# EAGLE design ps2_cpld_kbd (EAGLE 9.3.1)
CNAME: PS/2 keyboard adapter; CREVISION: 1.2; DESIGNER: andykarpov
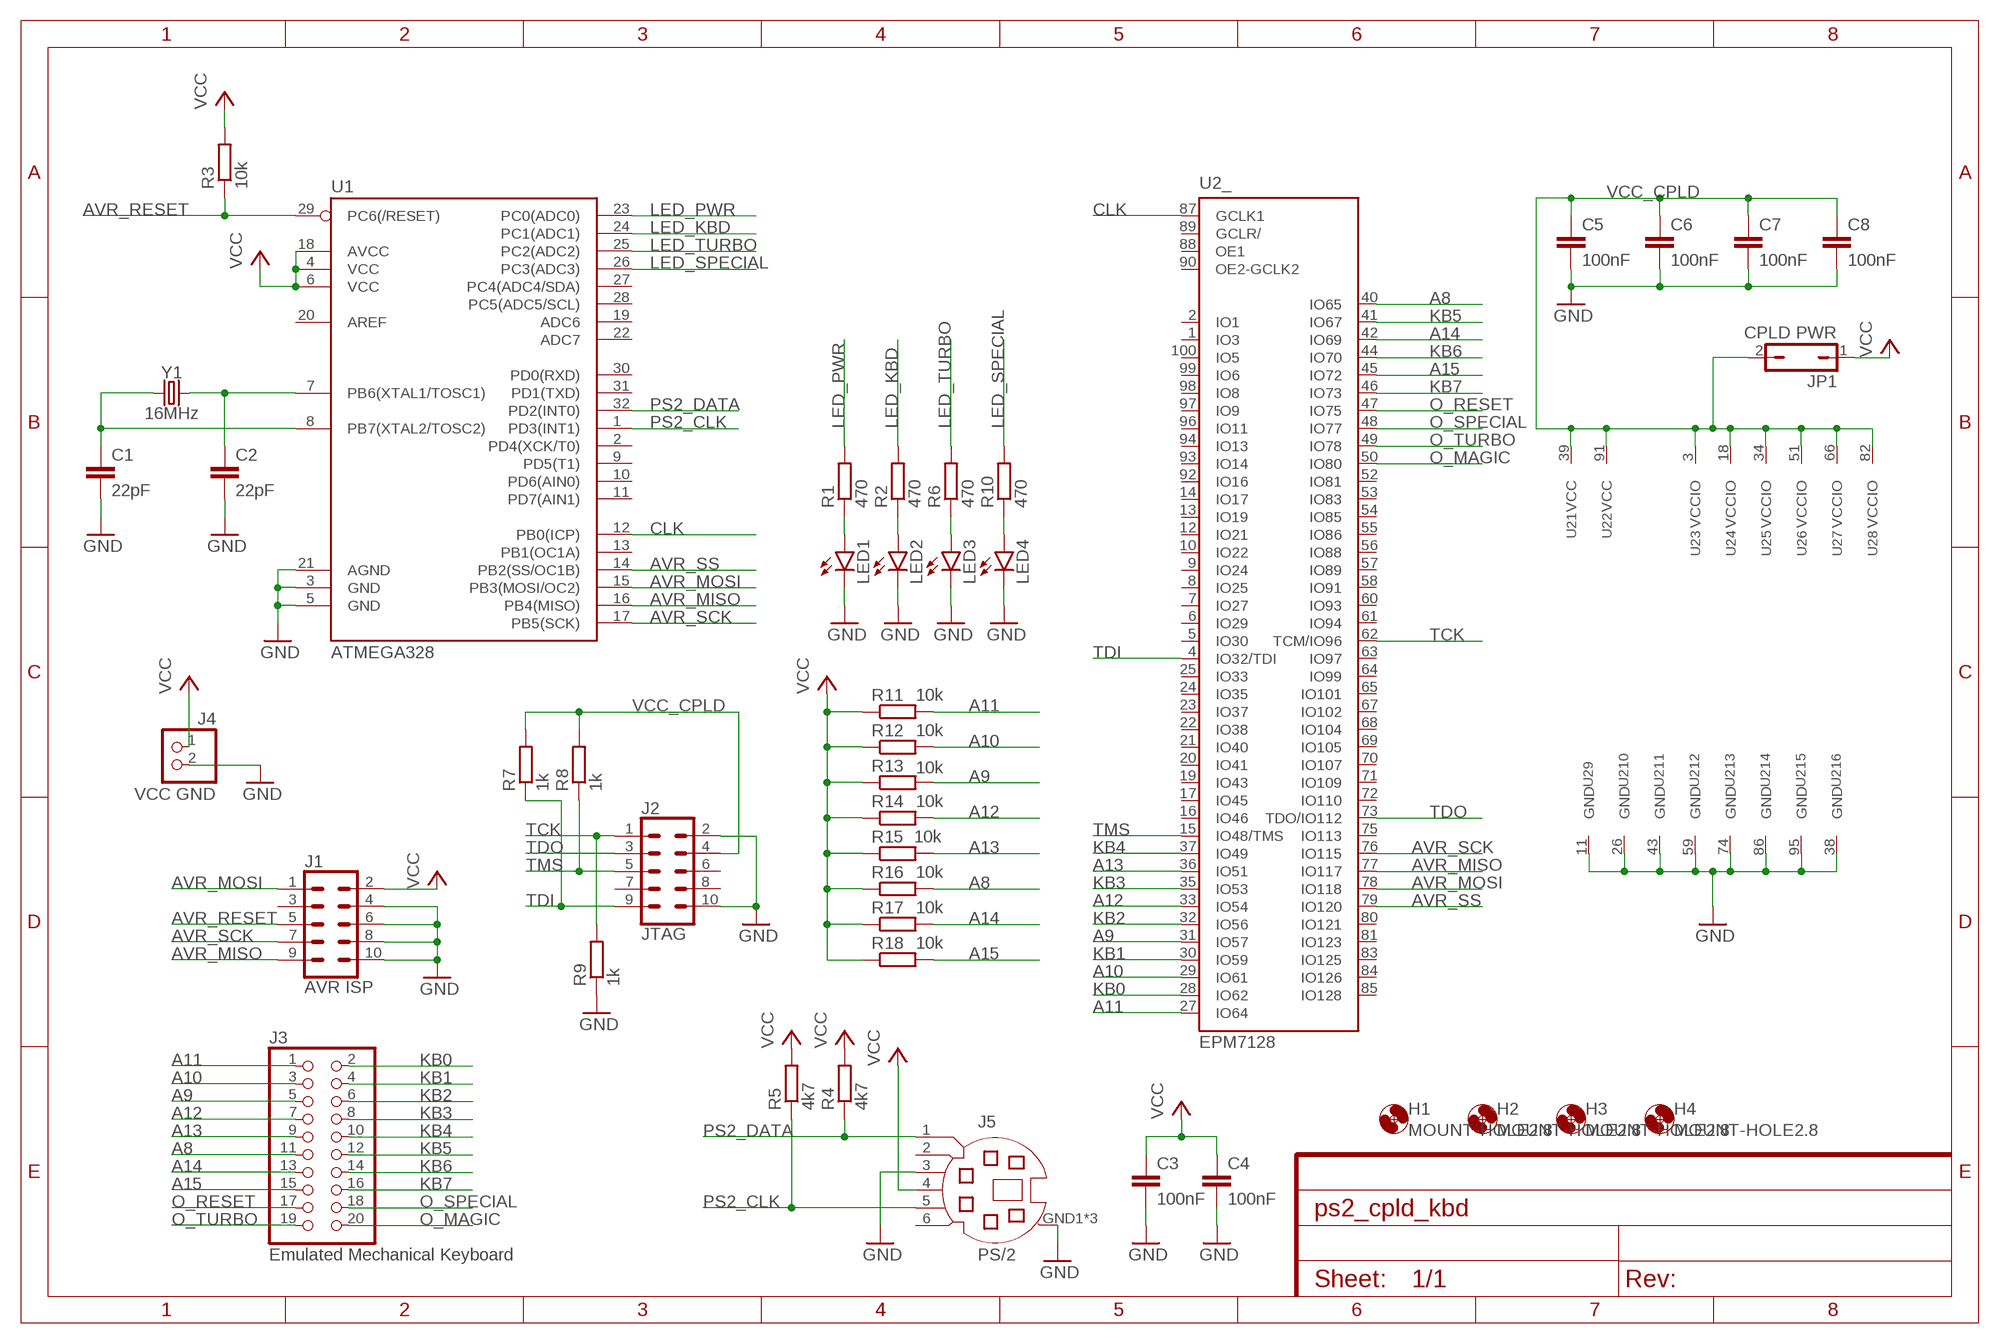
[diagram p0: schematic, sheet 1]

## Parts
C1  22pF  C-EUC0805K  [C0805K]
C2  22pF  C-EUC0805K  [C0805K]
C3  100nF  C-EUC0805K  [C0805K]
C4  100nF  C-EUC0805K  [C0805K]
C5  100nF  C-EUC0805K  [C0805K]
C6  100nF  C-EUC0805K  [C0805K]
C7  100nF  C-EUC0805K  [C0805K]
C8  100nF  C-EUC0805K  [C0805K]
H1  MOUNT-HOLE2.8  [2,8]
H2  MOUNT-HOLE2.8  [2,8]
H3  MOUNT-HOLE2.8  [2,8]
H4  MOUNT-HOLE2.8  [2,8]
J1  AVR ISP  CONN_05X2SHD_LOCK  [2X5-SHROUDED_LOCK]
J2  JTAG  CONN_05X2SHD_LOCK  [2X5-SHROUDED_LOCK]
J3  Emulated Mechanical Keyboard  PINHD-2X10  [2X10]
J4  VCC GND  PINHD-1X2  [1X02]
J5  PS/2  MD06SS  [MDIN06SS]
JP1  CPLD PWR  JP1Q  [JP1]
LED1  LEDCHIPLED_0805  [CHIPLED_0805]
LED2  LEDCHIPLED_0805  [CHIPLED_0805]
LED3  LEDCHIPLED_0805  [CHIPLED_0805]
LED4  LEDCHIPLED_0805  [CHIPLED_0805]
R1  470  R-EU_R0805  [R0805]
R2  470  R-EU_R0805  [R0805]
R3  10k  R-EU_R0805  [R0805]
R4  4k7  R-EU_R0805  [R0805]
R5  4k7  R-EU_R0805  [R0805]
R6  470  R-EU_R0805  [R0805]
R7  1k  R-EU_R0805  [R0805]
R8  1k  R-EU_R0805  [R0805]
R9  1k  R-EU_R0805  [R0805]
R10  470  R-EU_R0805  [R0805]
R11  10k  R-EU_R0805  [R0805]
R12  10k  R-EU_R0805  [R0805]
R13  10k  R-EU_R0805  [R0805]
R14  10k  R-EU_R0805  [R0805]
R15  10k  R-EU_R0805  [R0805]
R16  10k  R-EU_R0805  [R0805]
R17  10k  R-EU_R0805  [R0805]
R18  10k  R-EU_R0805  [R0805]
U1  ATMEGA328  ATMEGA328P_TQFP  [TQFP32-08]
U2  EPM7128  EPM7128-T100  [TQFP100]
Y1  16MHz  CRYSTAL-16MHZPTH-HC49US  [HC49US]

## Nets
A8: J3.11 R16.2 U2.40(_:IO65)
A9: J3.5 R13.2 U2.31(_:IO57)
A10: J3.3 R12.2 U2.29(_:IO61)
A11: J3.1 R11.2 U2.27(_:IO64)
A12: J3.7 R14.2 U2.33(_:IO54)
A13: J3.9 R15.2 U2.36(_:IO51)
A14: J3.13 R17.2 U2.42(_:IO69)
A15: J3.15 R18.2 U2.45(_:IO72)
AVR_MISO: J1.9 U1.16(PB4(MISO)) U2.77(_:IO117)
AVR_MOSI: J1.1 U1.15(PB3(MOSI/OC2)) U2.78(_:IO118)
AVR_RESET: J1.5 R3.1 U1.29(PC6(/RESET))
AVR_SCK: J1.7 U1.17(PB5(SCK)) U2.76(_:IO115)
AVR_SS: U1.14(PB2(SS/OC1B)) U2.79(_:IO120)
CLK: U1.12(PB0(ICP)) U2.87(_:GCLK1)
GND: C1.2 C2.2 C3.2 C4.2 C5.2 C6.2 C7.2 C8.2 J1.4 J1.6 J1.8 J1.10 J2.2 J2.10 J4.2 J5.3 J5.GND1(GND) J5.GND2(GND) J5.GND3(GND) LED1.C LED2.C LED3.C LED4.C R9.1 U1.3(GND) U1.5(GND) U1.21(AGND) U2.11(9:GND) U2.26(10:GND) U2.38(16:GND) U2.43(11:GND) U2.59(12:GND) U2.74(13:GND) U2.86(14:GND) U2.95(15:GND)
KB0: J3.2 U2.28(_:IO62)
KB1: J3.4 U2.30(_:IO59)
KB2: J3.6 U2.32(_:IO56)
KB3: J3.8 U2.35(_:IO53)
KB4: J3.10 U2.37(_:IO49)
KB5: J3.12 U2.41(_:IO67)
KB6: J3.14 U2.44(_:IO70)
KB7: J3.16 U2.46(_:IO73)
LED_KBD: R2.2 U1.24(PC1(ADC1))
LED_PWR: R1.2 U1.23(PC0(ADC0))
LED_SPECIAL: R10.2 U1.26(PC3(ADC3))
LED_TURBO: R6.2 U1.25(PC2(ADC2))
N$1: LED3.A R6.1
N$2: LED2.A R2.1
N$3: LED1.A R1.1
N$4: C2.1 U1.7(PB6(XTAL1/TOSC1)) Y1.2
N$5: C1.1 U1.8(PB7(XTAL2/TOSC2)) Y1.1
N$6: LED4.A R10.1
O_MAGIC: J3.20 U2.50(_:IO80)
O_RESET: J3.17 U2.47(_:IO75)
O_SPECIAL: J3.18 U2.48(_:IO77)
O_TURBO: J3.19 U2.49(_:IO78)
PS2_CLK: J5.5 R5.1 U1.1(PD3(INT1))
PS2_DATA: J5.1 R4.1 U1.32(PD2(INT0))
TCK: J2.1 R9.2 U2.62(_:TCM/IO96)
TDI: J2.9 R7.1 U2.4(_:IO32/TDI)
TDO: J2.3 U2.73(_:TDO/IO112)
TMS: J2.5 R8.1 U2.15(_:IO48/TMS)
VCC: C3.1 C4.1 J1.2 J4.1 J5.4 JP1.1 R3.2 R4.2 R5.2 R11.1 R12.1 R13.1 R14.1 R15.1 R16.1 R17.1 R18.1 U1.4(VCC) U1.6(VCC) U1.18(AVCC)
VCC_CPLD: C5.1 C6.1 C7.1 C8.1 J2.4 JP1.2 R7.2 R8.2 U2.3(3:VCCIO) U2.18(4:VCCIO) U2.34(5:VCCIO) U2.39(1:VCC) U2.51(6:VCCIO) U2.66(7:VCCIO) U2.82(8:VCCIO) U2.91(2:VCC)
Unconnected: J1.3 J2.6 J2.7 J2.8 J5.2 J5.6 U1.2(PD4(XCK/T0)) U1.9(PD5(T1)) U1.10(PD6(AIN0)) U1.11(PD7(AIN1)) U1.13(PB1(OC1A)) U1.19(ADC6) U1.20(AREF) U1.22(ADC7) U1.27(PC4(ADC4/SDA)) U1.28(PC5(ADC5/SCL)) U1.30(PD0(RXD)) U1.31(PD1(TXD)) U2.1(_:IO3) U2.2(_:IO1) U2.5(_:IO30) U2.6(_:IO29) U2.7(_:IO27) U2.8(_:IO25) U2.9(_:IO24) U2.10(_:IO22) U2.12(_:IO21) U2.13(_:IO19) U2.14(_:IO17) U2.16(_:IO46) U2.17(_:IO45) U2.19(_:IO43) U2.20(_:IO41) U2.21(_:IO40) U2.22(_:IO38) U2.23(_:IO37) U2.24(_:IO35) U2.25(_:IO33) U2.52(_:IO81) U2.53(_:IO83) U2.54(_:IO85) U2.55(_:IO86) U2.56(_:IO88) U2.57(_:IO89) U2.58(_:IO91) U2.60(_:IO93) U2.61(_:IO94) U2.63(_:IO97) U2.64(_:IO99) U2.65(_:IO101) U2.67(_:IO102) U2.68(_:IO104) U2.69(_:IO105) U2.70(_:IO107) U2.71(_:IO109) U2.72(_:IO110) U2.75(_:IO113) U2.80(_:IO121) U2.81(_:IO123) U2.83(_:IO125) U2.84(_:IO126) U2.85(_:IO128) U2.88(_:OE1) U2.89(_:GCLR/) U2.90(_:OE2-GCLK2) U2.92(_:IO16) U2.93(_:IO14) U2.94(_:IO13) U2.96(_:IO11) U2.97(_:IO9) U2.98(_:IO8) U2.99(_:IO6) U2.100(_:IO5)

## Library data of the parts
C1-C8 = resistor:C-EU: CAPACITOR, European symbol
H1-H4 = holes:MOUNT-HOLE: MOUNTING HOLE with drill center marker
J1 J2 = SparkFun-Connectors:CONN_05X2: Multi connection point. Often used as Generic Header-pin footprint for 0.1 inch spaced/style header connections For AVR SPI programming port, see special device with nice symbol: "AVR_SPI_PROG_5x2.dev" You can populate with any combo of single row headers, but if you'd like an exact match, check these: 2x5 AVR ICSP Male Header <https://www.sparkfun.com/products/778> (PRT-00778) 2x5 Pin Shrouded Header <https://www.sparkfun.com/products/8506> (PRT-08506) On any of the 0.1 inch spaced packages, you can populate with these: Break Away Headers - Straight <https://www.sparkfun.com/products/116> (PRT-00116) Break Away Male Headers - Right Angle <https://www.sparkfun.com/products/553> (PRT-00553) Female Headers <https://www.sparkfun.com/products/115> (PRT-00115) Break Away Headers - Machine Pin <https://www.sparkfun.com/products/117> (PRT-00117) Break Away Female Headers - Swiss Machine Pin <https://www.sparkfun.com/products/743> (PRT-00743) Special note: the shrouded connector mates well with our 5x2 ribbon cables: 2x5 Pin IDC Ribbon Cable <https://www.sparkfun.com/products/8535> (PRT-08535); PROD_ID: CONN-08671; SF_ID: PRT-08506
J3 = pinhead:PINHD-2X10: PIN HEADER
J4 = pinhead-mod:PINHD-1X2: PIN HEADER
J5 = con-yamaichi-mod:MD06SS: YAMAICHI CONNECTOR; OC_FARNELL: unknown; OC_NEWARK: unknown
JP1 = jumper-mod:JP1Q: JUMPER
LED1-LED4 = led:LED: LED OSRAM: - CHIPLED LG R971, LG N971, LY N971, LG Q971, LY Q971, LO R971, LY R971 LH N974, LH R974 LS Q976, LO Q976, LY Q976 LO Q996 - Hyper CHIPLED LW Q18S LB Q993, LB Q99A, LB R99A - SideLED LS A670, LO A670, LY A670, LG A670, LP A670 LB A673, LV A673, LT A673, LW A673 LH A674 LY A675 LS A676, LA A676, LO A676, LY A676, LW A676 LS A679, LY A679, LG A679 - Hyper Micro SIDELED® LS Y876, LA Y876, LO Y876, LY Y876 LT Y87S - SmartLED LW L88C, LW L88S LB L89C, LB L89S, LG L890 LS L89K, LO L89K, LY L89K LS L896, LA L896, LO L896, LY L896 - TOPLED LS T670, LO T670, LY T670, LG T670, LP T670 LSG T670, LSP T670, LSY T670, LOP T670, LYG T670 LG T671, LOG T671, LSG T671 LB T673, LV T673, LT T673, LW T673 LH T674 LS T676, LA T676, LO T676, LY T676, LB T676, LH T676, LSB T676, LW T676 LB T67C, LV T67C, LT T67C, LS T67K, LO T67K, LY T67K, LW E67C LS E67B, LA E67B, LO E67B, LY E67B, LB E67C, LV E67C, LT E67C LW T67C LS T679, LY T679, LG T679 LS T770, LO T770, LY T770, LG T770, LP T770 LB T773, LV T773, LT T773, LW T773 LH T774 LS E675, LA E675, LY E675, LS T675 LS T776, LA T776, LO T776, LY T776, LB T776 LHGB T686 LT T68C, LB T68C - Hyper Mini TOPLED® LB M676 - Mini TOPLED Santana® LG M470 LS M47K, LO M47K, LY M47K Source: http://www.osram.convergy.de LUXEON: - LUMILED® LXK2-PW12-R00, LXK2-PW12-S00, LXK2-PW14-U00, LXK2-PW14-V00 LXK2-PM12-R00, LXK2-PM12-S00, LXK2-PM14-U00 LXK2-PE12-Q00, LXK2-PE12-R00, LXK2-PE12-S00, LXK2-PE14-T00, LXK2-PE14-U00 LXK2-PB12-K00, LXK2-PB12-L00, LXK2-PB12-M00, LXK2-PB14-N00, LXK2-PB14-P00, LXK2-PB14-Q00 LXK2-PR12-L00, LXK2-PR12-M00, LXK2-PR14-Q00, LXK2-PR14-R00 LXK2-PD12-Q00, LXK2-PD12-R00, LXK2-PD12-S00 LXK2-PH12-R00, LXK2-PH12-S00 LXK2-PL12-P00, LXK2-PL12-Q00, LXK2-PL12-R00 Source: www.luxeon.com KINGBRIGHT: KA-3528ASYC Source: www.kingbright.com
R1-R18 = rcl:R-EU_: RESISTOR, European symbol; SPICEPREFIX: R
U1 = SparkFun-IC-Microcontroller:ATMEGA328P_TQFP: Popular 328P in QFP Storefront component: ATmega328 - TQFP <https://www.sparkfun.com/products/13448> (COM-13448) Datasheet <http://www.sparkfun.com/datasheets/Components/SMD/ATMega328.pdf> SparkFun Products SparkFun RedBoard - Programmed with Arduino <https://www.sparkfun.com/products/12757> (DEV-12757) Arduino Pro Mini 328 - 5V/16MHz <https://www.sparkfun.com/products/11113> (DEV-11113) Arduino Pro Mini 328 - 3.3V/8MHz <https://www.sparkfun.com/products/11114> (DEV-11114) SparkFun OpenLog <https://www.sparkfun.com/products/13712> (DEV-13712) SparkFun MicroView - OLED Arduino Module <https://www.sparkfun.com/products/12923> (DEV-12923) SparkFun Digital Sandbox <https://www.sparkfun.com/products/12651> (DEV-12651) SparkFun PicoBoard <https://www.sparkfun.com/products/11888> (WIG-11888) Arduino Fio <https://www.sparkfun.com/products/10116> (DEV-10116) LilyPad Arduino 328 Main Board <https://www.sparkfun.com/products/13342> (DEV-13342) SparkFun RedStick <https://www.sparkfun.com/products/13741> (DEV-13741) LilyPad MP3 <https://www.sparkfun.com/products/11013> (DEV-11013) LilyPad Arduino SimpleSnap <https://www.sparkfun.com/products/10941> (DEV-10941) SparkFun Stepoko <https://www.sparkfun.com/products/13899> (ROB-13899) SparkFun Geiger Counter <https://www.sparkfun.com/products/11345> (SEN-11345) SparkFun EL Sequencer <https://www.sparkfun.com/products/12781> (COM-12781) Arduino Pro 328 - 5V/16MHz <https://www.sparkfun.com/products/10915> (DEV-10915) CryptoCape <https://www.sparkfun.com/products/12773> (DEV-12773) SparkFun IR Thermometer Evaluation Board - MLX90614 <https://www.sparkfun.com/products/10740> (SEN-10740) SparkFun RedBot Mainboard <https://www.sparkfun.com/products/12097> (ROB-12097) Arduino Pro 328 - 3.3V/8MHz <https://www.sparkfun.com/products/10914> (DEV-10914) SparkFun Block for Intel® Edison - Arduino <https://www.sparkfun.com/products/13036> (DEV-13036) SparkFun Simon Says - Surface Mount Soldering Kit <https://www.sparkfun.com/products/10935> (KIT-10935) SparkFun 7-Segment Serial Display - Red <https://www.sparkfun.com/products/11441> (COM-11441) SparkFun 7-Segment Serial Display - White <https://www.sparkfun.com/products/11629> (COM-11629) SparkFun 7-Segment Serial Display - Yellow <https://www.sparkfun.com/products/11443> (COM-11443) SparkFun 7-Segment Serial Display - Kelly Green <https://www.sparkfun.com/products/11440> (COM-11440) SparkFun 7-Segment Serial Display - Blue <https://www.sparkfun.com/products/11442> (COM-11442) SparkFun OpenSegment Serial Display - 20mm (Blue) <https://www.sparkfun.com/products/11647> (COM-11647) SparkFun OpenSegment Serial Display - 20mm (Green) <https://www.sparkfun.com/products/11646> (COM-11646) SparkFun OpenSegment Serial Display - 20mm (White) <https://www.sparkfun.com/products/11648> (COM-11648) SparkFun OpenSegment Serial Display - 20mm (Red) <https://www.sparkfun.com/products/11644> (COM-11644) SparkFun OpenSegment Serial Display - 20mm (Yellow) <https://www.sparkfun.com/products/11645> (COM-11645) SparkFun OpenSegment Shield <https://www.sparkfun.com/products/13190> (DEV-13190); PROD_ID: IC-09069; VALUE: ATMEGA328P_TQFP
U2 = altera:EPM7128-?100: EPM70128 MAX 7000 family; MPN: EPM7128STC100-7N; OC_FARNELL: 1549427; OC_NEWARK: 51R9778
Y1 = SparkFun-Clocks:CRYSTAL-16MHZ: 16MHz Crystal Digikey Example <http://www.digikey.com/product-search/en?keywords=535-9122-1-ND> Frequency: 16MHz Frequency Stability: ±50ppm Frequency Tolerance: ±20ppm Load Capacitance: 18pF SparkFun Products: Pro Micro -5V/16MHz <https://www.sparkfun.com/products/12640> SparkFun Serial Enabled LCD Kit <https://www.sparkfun.com/products/10097>; PROD_ID: XTAL-08181; SF_ID: COM-00536

## Board
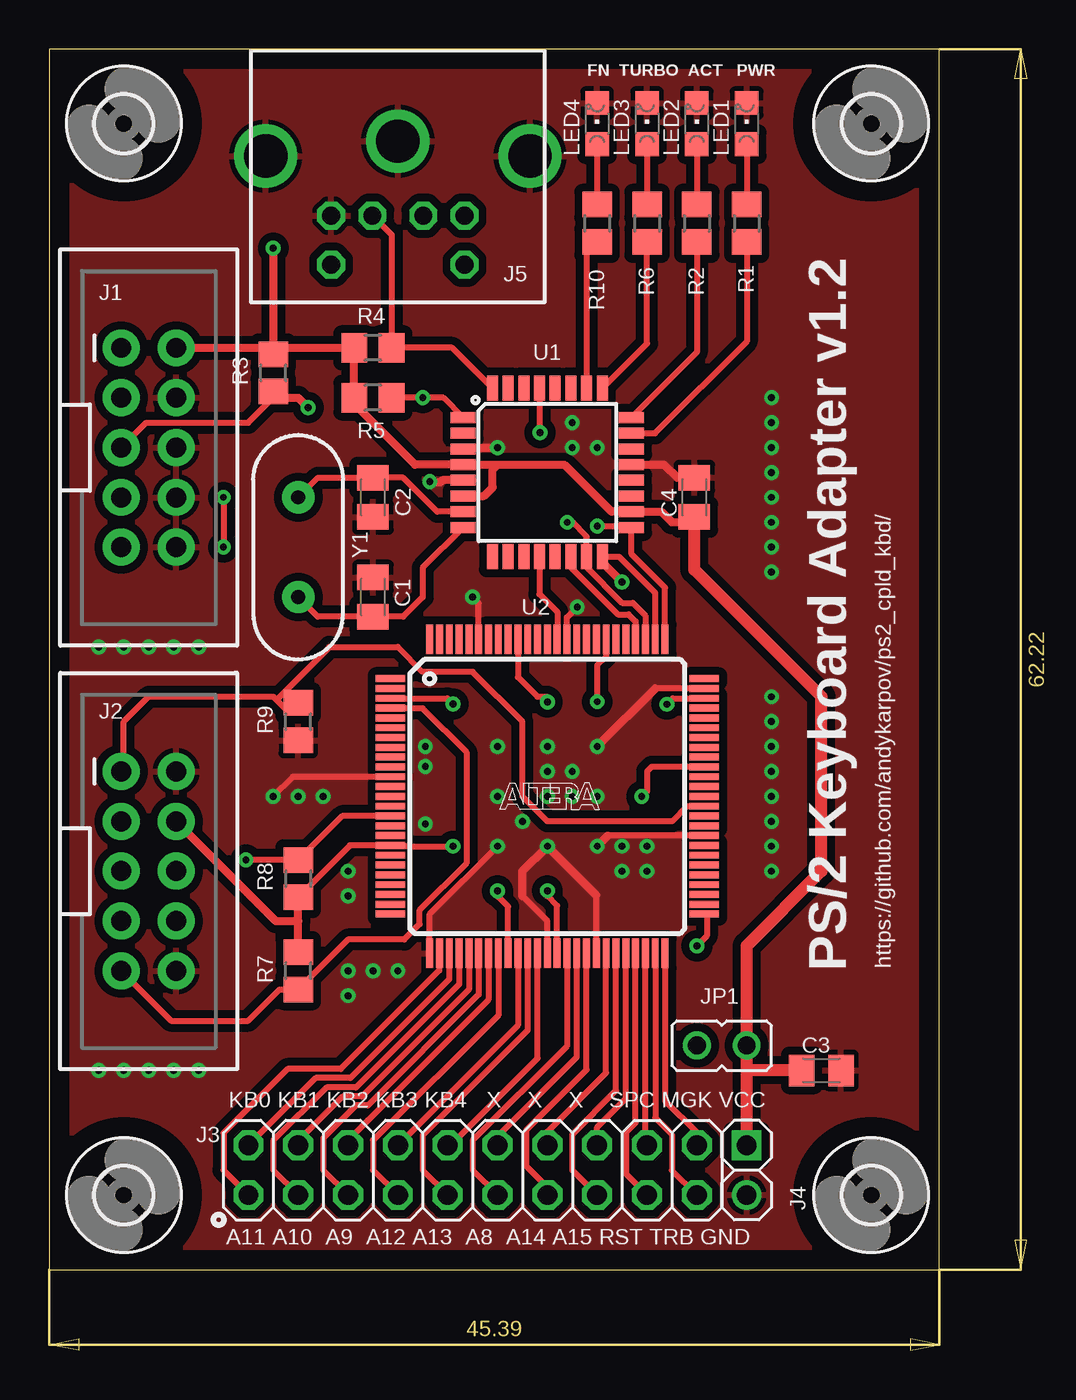
[diagram p1: board, top side]
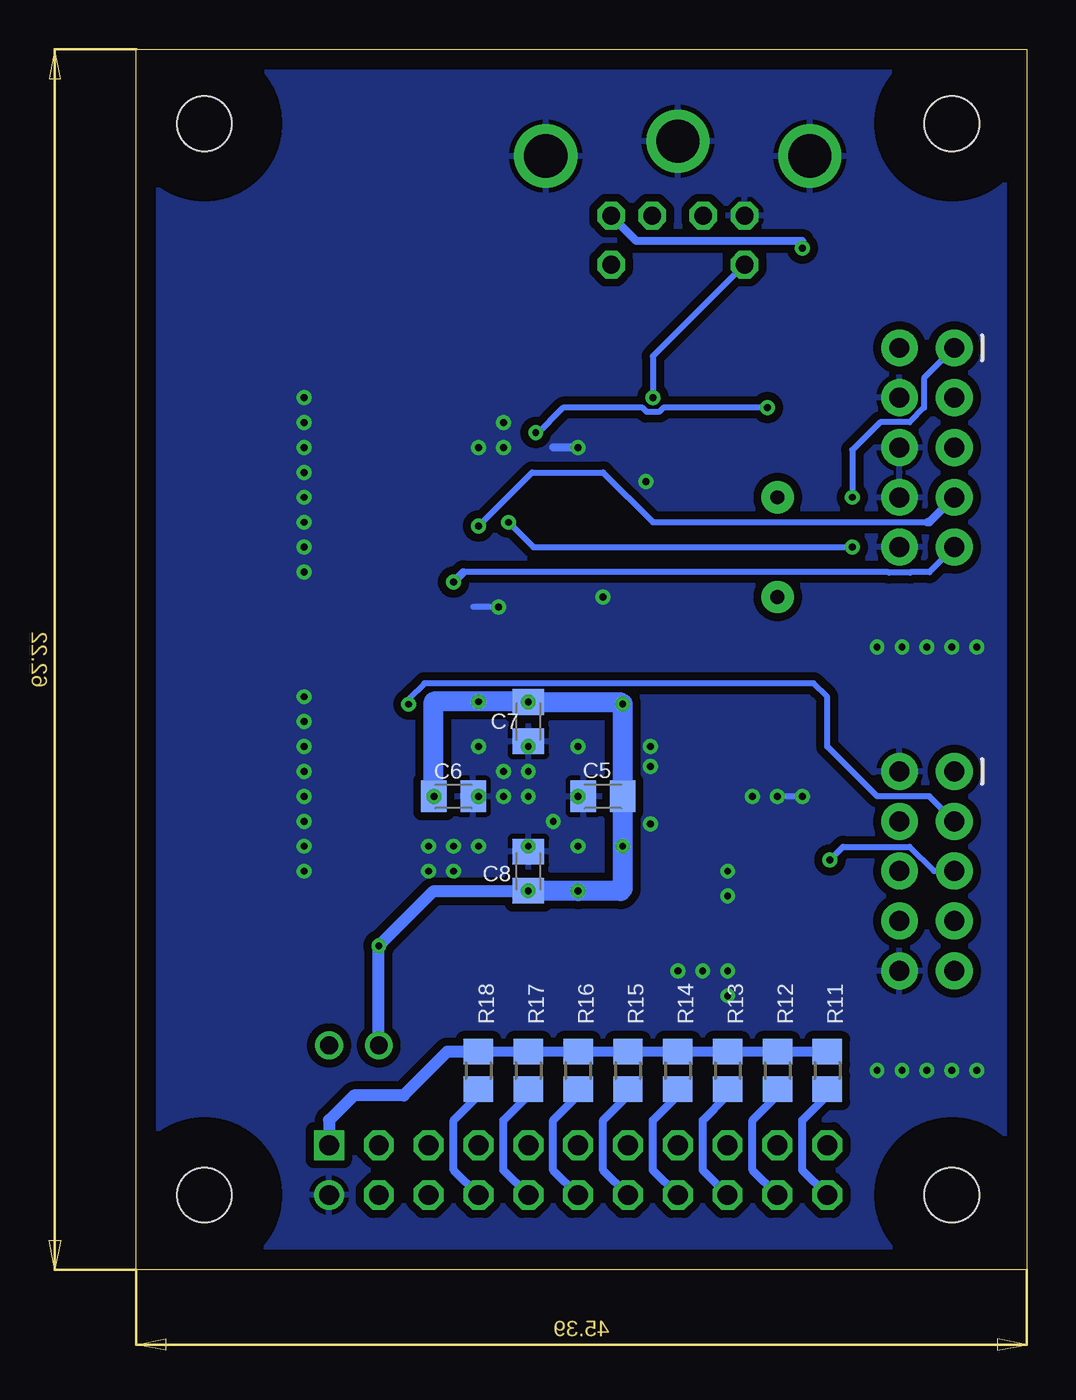
[diagram p2: board, bottom side, seen from below]

Size 45.39 x 62.22 mm. Coordinates in mm from the lower left corner, seen from the top.
Outline: 0,0 45.39,0 45.39,62.22 0,62.22 0,0
Copper layers (1*16): Top 0.035mm / dielectric 1.5mm / Bottom 0.035mm
Design rules "default *": minimum track width 6mil, minimum drill 0.35mm, track to track 6mil, track to pad 6mil, pad to pad 6mil, via to via 6mil, smd to smd 5mil, copper to edge 40mil, drill to drill 6mil, minimum pad ring 10mil, minimum via ring 8mil, stop-mask expansion 4mil, vias tented up to drill 15mil, thermal gap 10mil

### Footprints (pad centres in the part's own frame; a part is rotated, then mirrored left to right if it is on the bottom)
C0805K = smd 1.3 x 1.6: 1 -1,0; 2 1,0
2,8 = hole 2.8: 0,0
2X5-SHROUDED_LOCK = drill 1.016 pad 1.88: 1 -1.397,5.08; 2 1.397,5.08; 3 -1.397,2.54; 4 1.397,2.54; 5 -1.397,0; 6 1.397,0; 7 -1.397,-2.54; 8 1.397,-2.54; 9 -1.397,-5.08; 10 1.397,-5.08
2X10 = drill 1.016 octagon: 1 -11.43,-1.27; 2 -11.43,1.27; 3 -8.89,-1.27; 4 -8.89,1.27; 5 -6.35,-1.27; 6 -6.35,1.27; 7 -3.81,-1.27; 8 -3.81,1.27; 9 -1.27,-1.27; 10 -1.27,1.27; 11 1.27,-1.27; 12 1.27,1.27; 13 3.81,-1.27; 14 3.81,1.27; 15 6.35,-1.27; 16 6.35,1.27; 17 8.89,-1.27; 18 8.89,1.27; 19 11.43,-1.27; 20 11.43,1.27
1X02 = drill 1.016 square: 1 -1.27,0 | drill 1.016: 2 1.27,0
MDIN06SS = drill 0.9 octagon: 1 1.3,8.5; 2 -1.3,8.5; 3 3.4,8.5; 4 -3.4,8.5; 5 3.4,11; 6 -3.4,11 | drill 2.2: GND1 6.731,5.461; GND2 0,4.699; GND3 -6.731,5.461
JP1 = drill 0.914: 1 0,-1.27; 2 0,1.27
CHIPLED_0805 = smd 1.2 x 1.2: A 0,-1.05; C 0,1.05
R0805 = smd 1.3 x 1.5: 1 -0.95,0; 2 0.95,0
TQFP32-08 = smd 1.27 x 0.559: 1 -4.293,2.8; 2 -4.293,2; 3 -4.293,1.2; 4 -4.293,0.4; 5 -4.293,-0.4; 6 -4.293,-1.2; 7 -4.293,-2; 8 -4.293,-2.8; 17 4.293,-2.8; 18 4.293,-2; 19 4.293,-1.2; 20 4.293,-0.4; 21 4.293,0.4; 22 4.293,1.2; 23 4.293,2; 24 4.293,2.8 | smd 0.559 x 1.27: 9 -2.8,-4.293; 10 -2,-4.293; 11 -1.2,-4.293; 12 -0.4,-4.293; 13 0.4,-4.293; 14 1.2,-4.293; 15 2,-4.293; 16 2.8,-4.293; 25 2.8,4.293; 26 2,4.293; 27 1.2,4.293; 28 0.4,4.293; 29 -0.4,4.293; 30 -1.2,4.293; 31 -2,4.293; 32 -2.8,4.293
TQFP100 = smd 1.5 x 0.35: 1 -8,6; 2 -8,5.5; 3 -8,5; 4 -8,4.5; 5 -8,4; 6 -8,3.5; 7 -8,3; 8 -8,2.5; 9 -8,2; 10 -8,1.5; 11 -8,1; 12 -8,0.5; 13 -8,0; 14 -8,-0.5; 15 -8,-1; 16 -8,-1.5; 17 -8,-2; 18 -8,-2.5; 19 -8,-3; 20 -8,-3.5; 21 -8,-4; 22 -8,-4.5; 23 -8,-5; 24 -8,-5.5; 25 -8,-6; 51 8,-6; 52 8,-5.5; 53 8,-5; 54 8,-4.5; 55 8,-4; 56 8,-3.5; 57 8,-3; 58 8,-2.5; 59 8,-2; 60 8,-1.5; 61 8,-1; 62 8,-0.5; 63 8,0; 64 8,0.5; 65 8,1; 66 8,1.5; 67 8,2; 68 8,2.5; 69 8,3; 70 8,3.5; 71 8,4; 72 8,4.5; 73 8,5; 74 8,5.5; 75 8,6 | smd 0.35 x 1.5: 26 -6,-8; 27 -5.5,-8; 28 -5,-8; 29 -4.5,-8; 30 -4,-8; 31 -3.5,-8; 32 -3,-8; 33 -2.5,-8; 34 -2,-8; 35 -1.5,-8; 36 -1,-8; 37 -0.5,-8; 38 0,-8; 39 0.5,-8; 40 1,-8; 41 1.5,-8; 42 2,-8; 43 2.5,-8; 44 3,-8; 45 3.5,-8; 46 4,-8; 47 4.5,-8; 48 5,-8; 49 5.5,-8; 50 6,-8; 76 6,8; 77 5.5,8; 78 5,8; 79 4.5,8; 80 4,8; 81 3.5,8; 82 3,8; 83 2.5,8; 84 2,8; 85 1.5,8; 86 1,8; 87 0.5,8; 88 0,8; 89 -0.5,8; 90 -1,8; 91 -1.5,8; 92 -2,8; 93 -2.5,8; 94 -3,8; 95 -3.5,8; 96 -4,8; 97 -4.5,8; 98 -5,8; 99 -5.5,8; 100 -6,8
HC49US = drill 0.7 pad 1.651: 1 -2.54,0; 2 2.54,0

### Placement (x,y rotation side)
C1  16.51,34.29 90 top
C2  16.51,39.37 270 top
C3  39.37,10.16 0 top
C4  32.89,39.37 90 top
C5  21.59,24.13 180 bottom
C6  29.21,24.13 0 bottom
C7  25.4,27.94 270 bottom
C8  25.4,20.32 90 bottom
H1  41.91,3.81 0 top
H2  41.91,58.42 0 top
H3  3.81,3.81 0 top
H4  3.81,58.42 0 top
J1  5.08,41.91 0 top
J2  5.08,20.32 0 top
J3  21.59,5.08 0 top
J4  35.56,5.08 270 top
J5  17.78,62.23 180 top
JP1  34.29,11.43 90 top
LED1  35.56,58.42 0 top
LED2  33.02,58.42 0 top
LED3  30.48,58.42 0 top
LED4  27.94,58.42 0 top
R1  35.56,53.34 270 top
R2  33.02,53.34 270 top
R3  11.43,45.72 90 top
R4  16.51,46.99 180 top
R5  16.51,44.45 180 top
R6  30.48,53.34 270 top
R7  12.7,15.24 90 top
R8  12.7,19.94 270 top
R9  12.7,27.94 90 top
R10  27.94,53.34 270 top
R11  10.16,10.16 270 bottom
R12  12.7,10.16 270 bottom
R13  15.24,10.16 270 bottom
R14  17.78,10.16 270 bottom
R15  20.32,10.16 270 bottom
R16  22.86,10.16 270 bottom
R17  25.4,10.16 270 bottom
R18  27.94,10.16 270 bottom
U1  25.4,40.64 0 top
U2  25.4,24.13 0 top
Y1  12.7,36.83 90 top

### Tracks (layer width: path | path; a pad name or v marks a point on that pad's centre or on a via)
A8
  Top 0.305: U2.40 26.4,11.4 21.59,6.59 21.59,5.08 J3.11
  Bottom 0.406: J3.11 24.13,5.08 24.13,7.62 22.86,8.89 R16.2
A9
  Top 0.305: J3.5 13.97,5.08 13.97,6.71 15.64,8.38 16.26,8.38 21.9,14.03 U2.31
  Bottom 0.406: J3.5 16.51,5.08 16.51,7.62 15.24,8.89 R13.2
A10
  Top 0.305: J3.3 11.43,5.08 11.43,6.59 14.14,9.3 15.65,9.3 20.9,14.55 U2.29
  Bottom 0.406: J3.3 13.97,5.08 13.97,7.62 12.7,8.89 R12.2
A11
  Top 0.305: J3.1 8.89,5.08 8.89,6.97 12.16,10.24 14.86,10.24 19.88,15.25 19.88,16.11 U2.27
  Bottom 0.406: J3.1 11.43,5.08 11.43,7.62 10.16,8.89 R11.2
A12
  Top 0.305: J3.7 16.51,5.08 16.51,6.62 16.54,6.62 22.9,12.98 U2.33
  Bottom 0.406: J3.7 19.05,5.08 19.05,7.62 17.78,8.89 R14.2
A13
  Top 0.305: U2.36 24.4,12.21 19.05,6.86 19.05,5.08 J3.9
  Bottom 0.406: J3.9 21.59,5.08 21.59,7.62 20.32,8.89 R15.2
A14
  Top 0.305: U2.42 27.4,10.2 24.33,7.13 24.33,5.28 25.4,4.22 J3.13
  Bottom 0.406: J3.13 26.67,5.08 26.67,7.62 25.4,8.89 R17.2
A15
  Top 0.305: J3.15 26.67,5.08 26.67,6.9 28.9,9.13 U2.45
  Bottom 0.406: J3.15 29.21,5.08 29.21,7.62 27.94,8.89 R18.2
AVR_MISO  (via drill 0.35)
  Top 0.305: U2.77 30.9,34.51 29.06,36.35 U1.16
  Top 0.406: U1.16 28.19,36.07 v29.21,35.05
  Bottom 0.305: J1.9 4.95,35.56 5.92,35.56 5.94,35.53 7.01,35.53 7.04,35.56 28.7,35.56
  Bottom 0.406: 28.7,35.56 v29.21,35.05
AVR_MOSI  (via drill 0.35)
  Top 0.305: v26.42,38.1 26.67,38.1 27.4,37.37 U1.15 27.36,36.31 27.36,35.84 29.21,33.99 29.76,33.99 30.4,33.35 U2.78 | v8.89,39.37 v8.89,36.83
  Bottom 0.305: v26.42,38.1 25.15,36.83 v8.89,36.83 | v8.89,39.37 8.89,41.78 7.47,43.2 5.96,43.2 5.23,43.93 5.23,45.44 J1.1
AVR_RESET  (via drill 0.35)
  Top 0.305: J1.5 4.95,43.18 10.16,43.18 11.43,44.45 R3.1 | v25.02,42.67 25.02,44.91
  Top 0.406: R3.1 11.75,44.45 12.7,44.45 v13.21,43.94 | 25.02,44.91 U1.29
  Bottom 0.305: 25.02,42.55 23.62,43.94 19.58,43.94 19.35,43.72 18.75,43.72 18.52,43.94 v13.21,43.94
  Bottom 0.406: 25.02,42.55 v25.02,42.67
AVR_SCK  (via drill 0.35)
  Top 0.305: U2.76 31.4,34.77 29.69,36.47 U1.17 29.63,37.91 v27.94,37.91
  Bottom 0.305: 5.08,38.1 19.05,38.1 21.59,40.64 25.21,40.64 v27.94,37.91
  Bottom 0.406: J1.7 4.95,38.1 5.08,38.1
AVR_SS
  Top 0.305: U2.79 29.9,33.05 29.54,33.4 29,33.4 26.56,35.84 26.56,36.31 U1.14
CLK
  Top 0.305: U1.12 25,34.44 25.91,33.53 U2.87
GND  (via drill 0.35)
  Top 0.305: U2.59 28.48,22.13 | U2.74 30.9,29.63 | U2.38 25.4,17.78 24.13,19.05 | U2.43 27.9,19.09 | U2.26 19.4,18.13 v22.86,21.59 | U2.95 21.9,33.98 v21.59,34.29 | U2.86 26.4,33.26 v26.92,33.78 | U2.11 12.43,25.13 v11.43,24.13
  Top 0.406: 28.48,22.13 v27.94,21.59 | 30.9,29.63 v27.94,26.67 | 24.13,19.05 24.13,20.32 v25.4,21.59 27.9,19.09 | U1.21 31.35,41.04 32.02,40.37 C4.2 | U1.3 21.18,41.91 v22.86,41.91 | U1.5 20.05,40.24 19.94,40.13 19.45,40.13 v19.41,40.18
  Bottom 0.305: v26.92,33.78 28.19,33.78 | v11.43,24.13 v12.7,24.13
  Bottom 0.406: v22.86,41.91 24.13,41.91
  other vias: 22.86,26.67 25.4,24.13 22.86,24.13 27.94,24.13 25.4,26.67 15.24,20.32 15.24,19.05 13.97,24.13 36.83,26.67 36.83,25.4 36.83,24.13 25.4,25.4 26.67,25.4 26.67,24.13 24.13,22.86 29.21,21.59 30.48,21.59 29.21,20.32 30.48,20.32 19.18,26.67 19.18,25.65 19.18,22.73 26.67,43.18 27.94,41.91 26.67,41.91 36.83,43.18 36.83,41.91 36.83,40.64 36.83,39.37 36.83,38.1 36.83,36.83 36.83,22.86 36.83,21.59 36.83,20.32 36.83,27.94 36.83,29.21 36.83,44.45 36.83,35.56 17.78,15.24 16.51,15.24 15.24,15.24 15.24,13.97 7.62,31.75 7.62,10.16 6.35,10.16 5.08,10.16 3.81,10.16 6.35,31.75 5.08,31.75 3.81,31.75 2.54,31.75 2.54,10.16
  pour Top (isolate 0.406): -1.27,63.5 48.26,63.5 48.26,-1.27 -1.27,-1.27
  pour Bottom (isolate 0.406): -1.27,63.5 46.99,63.5 46.99,-2.54 -1.27,-2.54
KB0
  Top 0.305: U2.28 20.4,14.81 15.37,9.78 13.59,9.78 J3.2
KB1
  Top 0.305: J3.4 12.7,6.57 14.96,8.84 15.95,8.84 21.4,14.29 U2.30
KB2
  Top 0.305: J3.6 15.24,6.6 16.26,7.62 22.4,13.76 U2.32
KB3
  Top 0.305: U2.35 23.9,12.47 J3.8
KB4
  Top 0.305: U2.37 24.9,10.78 20.47,6.35 J3.10
KB5
  Top 0.305: U2.41 26.9,10.85 22.86,6.81 J3.12
KB6
  Top 0.305: U2.44 28.4,10.04 25.4,7.04 J3.14
KB7
  Top 0.305: J3.16 27.94,7.27 29.4,8.73 U2.46
LED_KBD
  Top 0.305: R2.2 33.02,46.77 U1.24
LED_PWR
  Top 0.305: U1.23 30.89,42.64 35.56,47.31 R1.2
LED_SPECIAL
  Top 0.305: R10.2 27.4,51.85 U1.26
LED_TURBO
  Top 0.305: U1.25 30.48,47.21 R6.2
N$1
  Top 0.305: LED3.A R6.1
N$2
  Top 0.305: LED2.A R2.1
N$3
  Top 0.305: LED1.A R1.1
N$4
  Top 0.305: Y1.2 13.7,40.37 C2.1 18.05,40.37 19.78,38.64 U1.7
N$5
  Top 0.305: Y1.1 13.7,33.29 C1.1 18.05,33.29 19.05,34.29 19.05,35.78 U1.8
N$6
  Top 0.305: LED4.A R10.1
O_MAGIC
  Top 0.305: J3.20 33.02,7 31.4,8.62 U2.50
O_RESET
  Top 0.305: J3.17 30.48,3.83 29.41,4.89 29.41,7.01 29.9,7.49 U2.47
O_SPECIAL
  Top 0.305: J3.18 30.38,6.45 30.38,16.11 U2.48
O_TURBO
  Top 0.305: J3.19 31.75,5.08 31.75,6.9 30.9,7.75 U2.49
PS2_CLK  (via drill 0.35)
  Top 0.305: U1.1 20.1,44.45 v19.05,44.45 R5.1
  Bottom 0.305: J5.5 19.05,46.56 v19.05,44.45
PS2_DATA
  Top 0.305: U1.32 20.54,46.99 R4.1 17.46,52.75 J5.1
TCK
  Top 0.305: U2.62 33.38,23.61 32.52,23.61 31.77,22.86 25.4,22.86 24.13,24.13 24.13,27.94 21.59,30.48 19.05,30.48 17.78,31.75 14.29,31.75 11.59,29.05 | R9.2 12.22,28.41 11.59,29.05 | J2.1 3.81,25.53 3.81,27.94 5.08,29.21 11.43,29.21 11.59,29.05
TDI
  Top 0.305: J2.9 6.22,12.7 10.16,12.7 11.75,14.29 R7.1 15.24,16.83 18.1,16.83 18.89,17.62 18.89,18.34 21.27,20.72 21.27,26.39 19.05,28.61 17.42,28.61 U2.4
TDO  (via drill 0.35)
  Top 0.305: v31.5,28.83 31.8,29.13 U2.73
  Bottom 0.305: v31.5,28.83 31.5,29.09 30.69,29.89 10.85,29.89 10.16,29.21 10.16,26.67 7.62,24.13 4.95,24.13 J2.3
TMS  (via drill 0.35)
  Top 0.305: U2.15 14.94,23.13 R8.1 v10.03,20.89
  Bottom 0.305: J2.5 4.72,20.32 5.96,21.57 9.36,21.57 v10.03,20.89
VCC  (via drill 0.35)
  Top 0.305: 32.62,38.1 C4.1
  Top 0.406: J1.2 11.11,46.99 R3.2 | 32.62,38.1 31.75,38.1 31.21,38.64 U1.18 28.67,38.64 26.27,41.04 22.86,41.04 | 22.86,41.04 U1.4 18.65,41.04 15.24,44.45 R5.2 R4.2 11.75,46.99 R3.2 | v11.43,52.07 R3.2 | U1.6 22.17,39.44 22.61,39.88 22.61,40.79 22.86,41.04
  Top 0.61: J4.1 35.56,10.16 | 35.56,10.16 JP1.1 35.56,16.51 39.37,20.32 39.37,29.21 32.89,35.69 C4.1 | C3.1 35.56,10.16
  Bottom 0.406: J5.4 19.9,52.45 11.43,52.45 v11.43,52.07
  Bottom 0.508: R11.1 R12.1 R13.1 R14.1 R15.1 R16.1 R17.1 R18.1
  Bottom 0.61: R18.1 29.53,11.11 31.75,8.89 34.29,8.89 35.56,7.62 J4.1
VCC_CPLD  (via drill 0.35)
  Top 0.305: C8.1 25.4,19.05 25.9,18.55 U2.39 | C7.1 25.4,29.21 24.89,29.21 23.9,30.2 U2.91 | C6.1 30.48,24.4 30.48,25.4 30.71,25.63 U2.66 | v27.94,28.96 27.94,30.81 28.38,31.25 28.38,32.11 U2.82 | v20.59,21.59 18.3,21.59 18.28,21.61 17.78,21.61 17.76,21.63 U2.18 15.34,21.63 R8.2 | v20.59,28.84 20.3,29.13 U2.3 | v22.86,19.3 22.86,19.05 23.4,18.51 U2.34 | U2.51 33.53,18 33.53,17.02 v33.02,16.51
  Top 0.406: J2.4 11.56,17.78 12.7,17.78 | 12.7,17.78 R8.2 | R7.2 12.7,17.78
  Bottom 0.305: C6.1 30.23,24.15 | 20.72,28.94 20.7,28.96 v20.59,28.84 | 20.59,19.41 20.7,19.3 | 25.38,19.3 C8.1 | v27.94,28.96 25.42,28.96
  Bottom 0.61: 25.38,19.3 30.23,19.3 v33.02,16.51 JP1.2
  Bottom 1.016: 30.23,24.15 30.23,28.96 25.42,28.96 C7.1 20.72,28.94 | v20.59,28.84 C5.1 v20.59,21.59 20.59,19.41 | 20.7,19.3 v22.86,19.3 25.38,19.3
  other vias: 25.4,19.32 25.4,28.94 30.21,24.13

### Text on the board
tNames: FN TURBO ACT PWR | PS/2 Keyboard Adapter v1.2 | https://github.com/andykarpov/ps2_cpld_kbd/ | KB0 KB1 KB2 KB3 KB4 X X X SPC MGK VCC | A11 A10 A9 A12 A13 A8 A14 A15 RST TRB GND